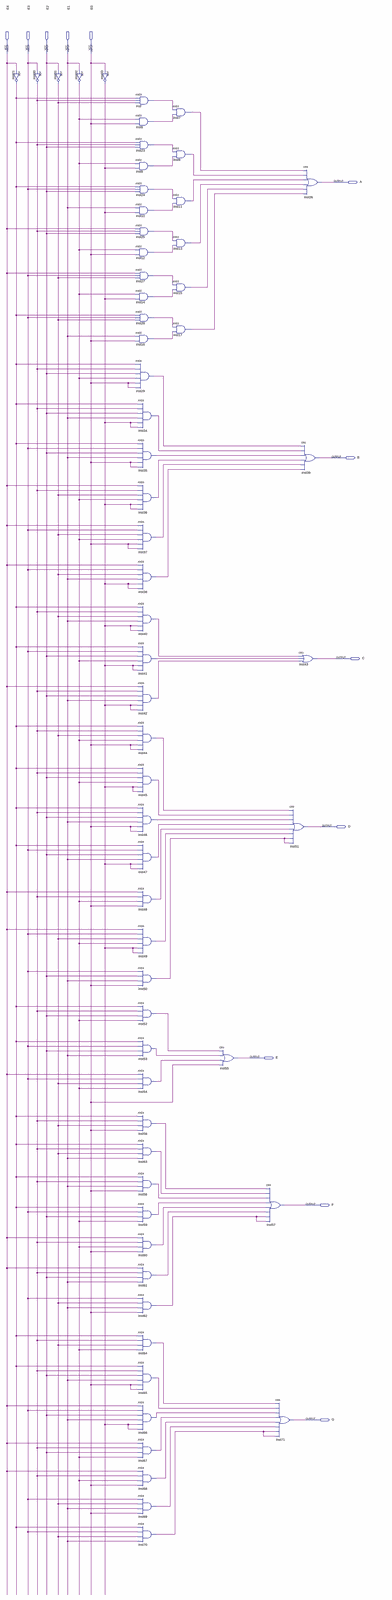
[diagram p0: schematic sheet, whole]
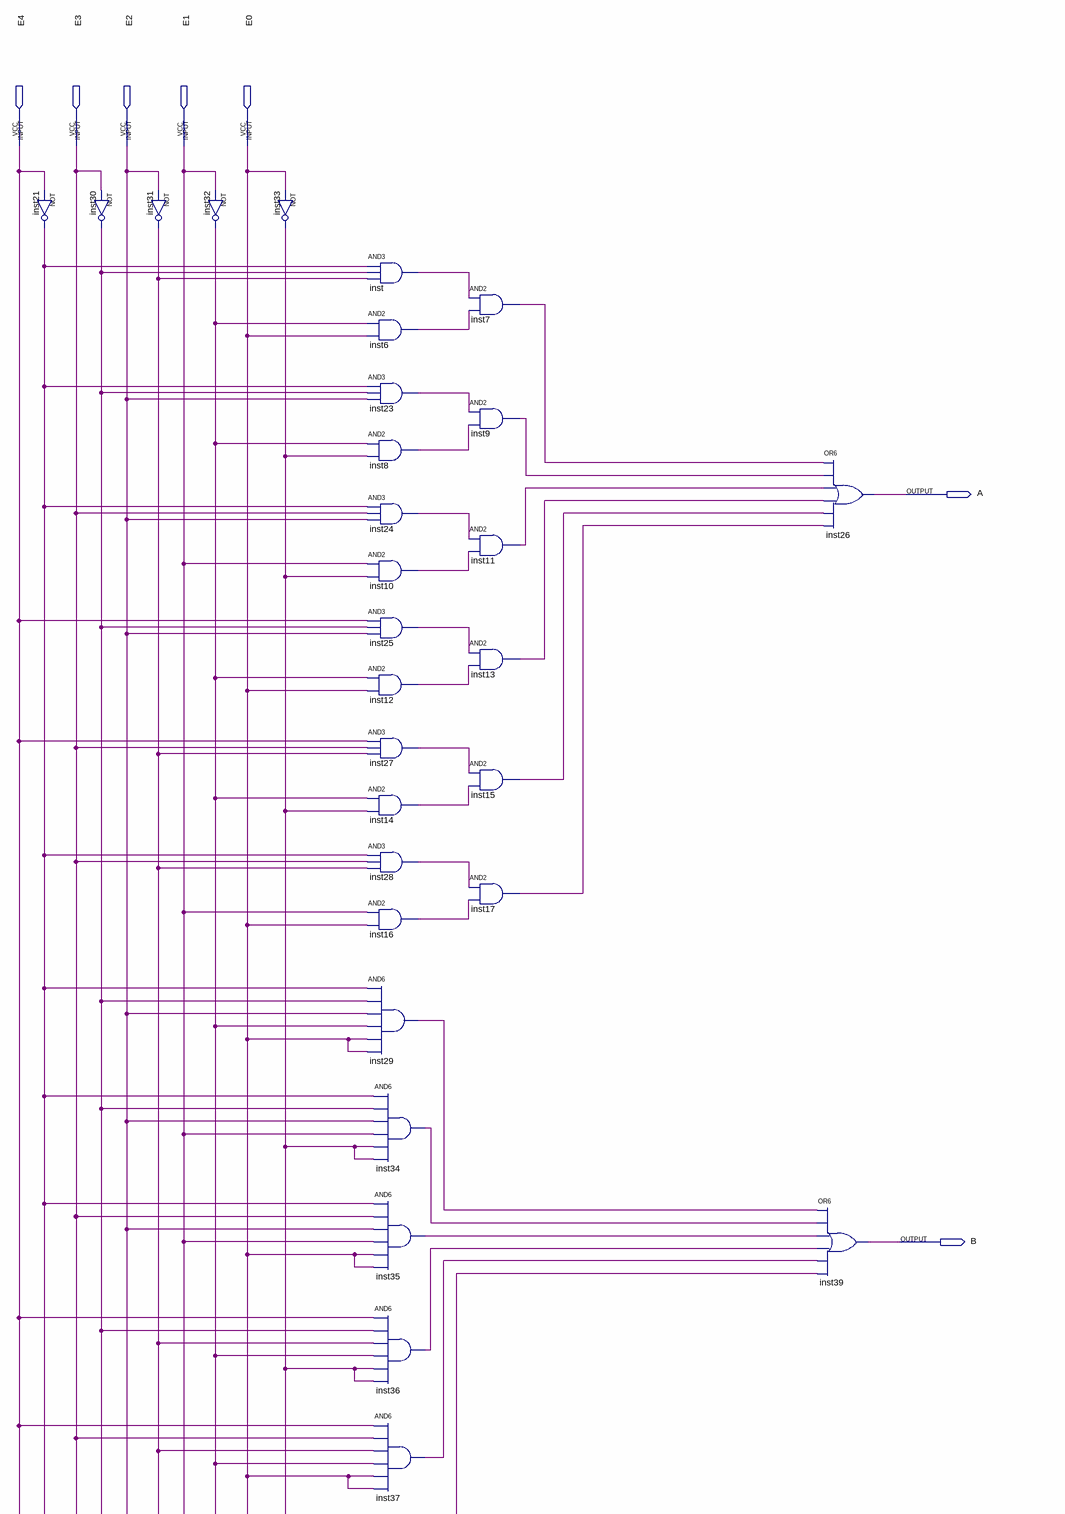
[diagram p1: schematic sheet, upper part]
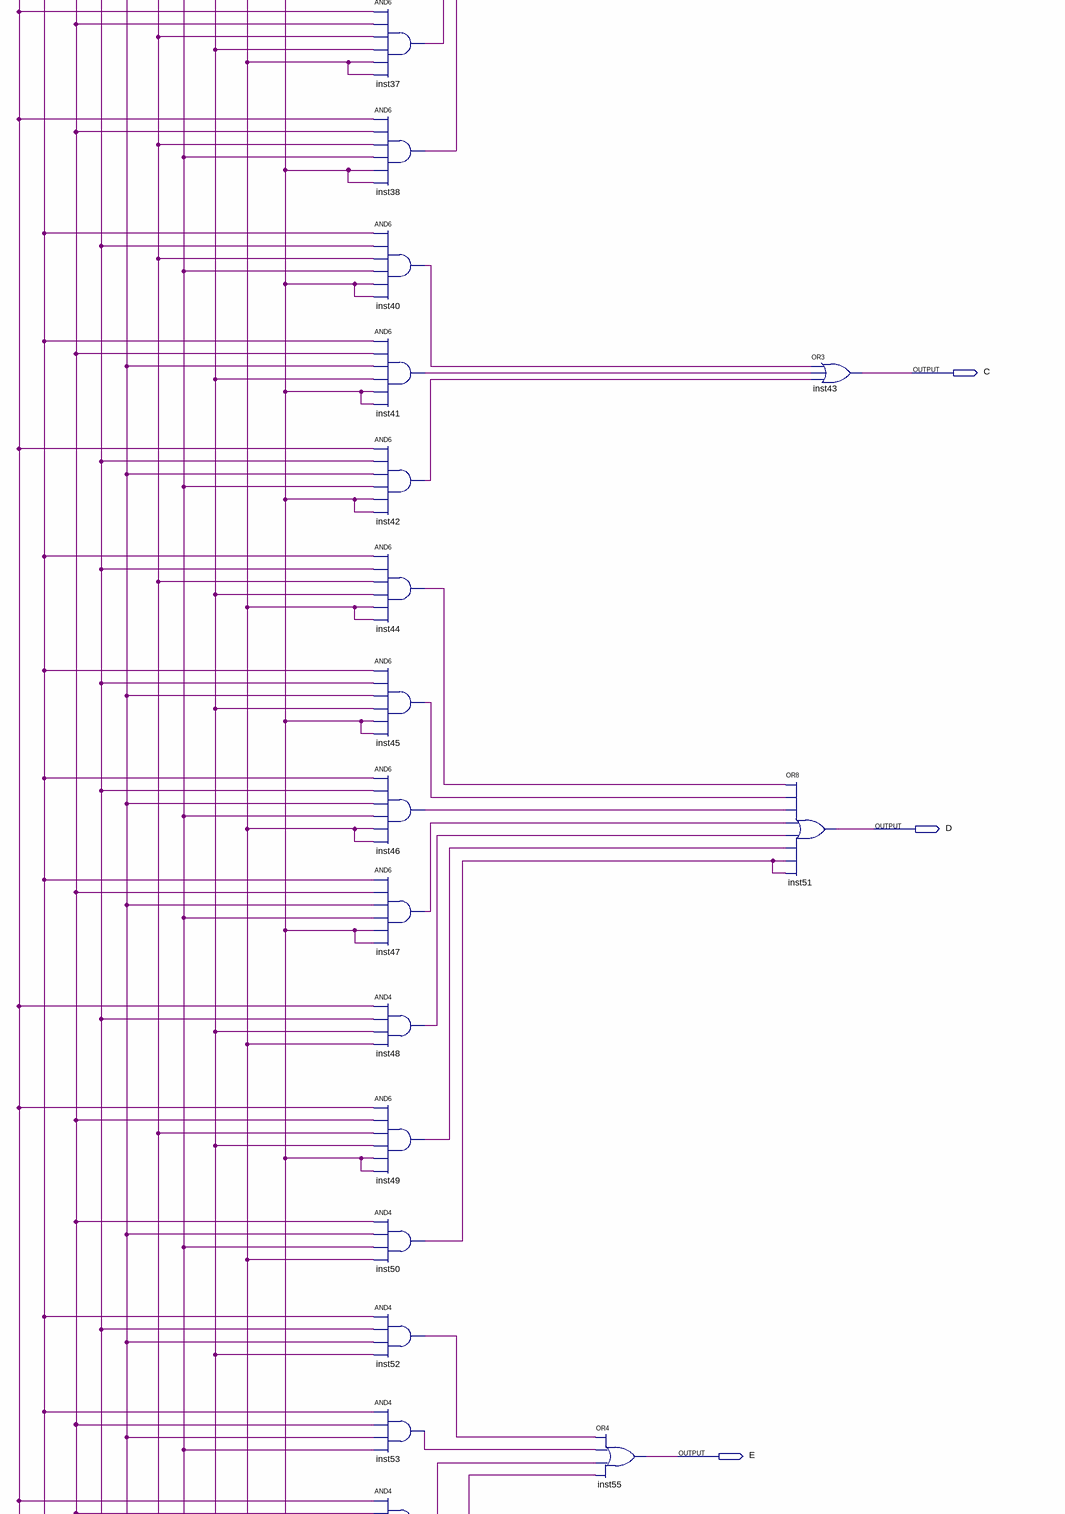
[diagram p2: schematic sheet, middle part]
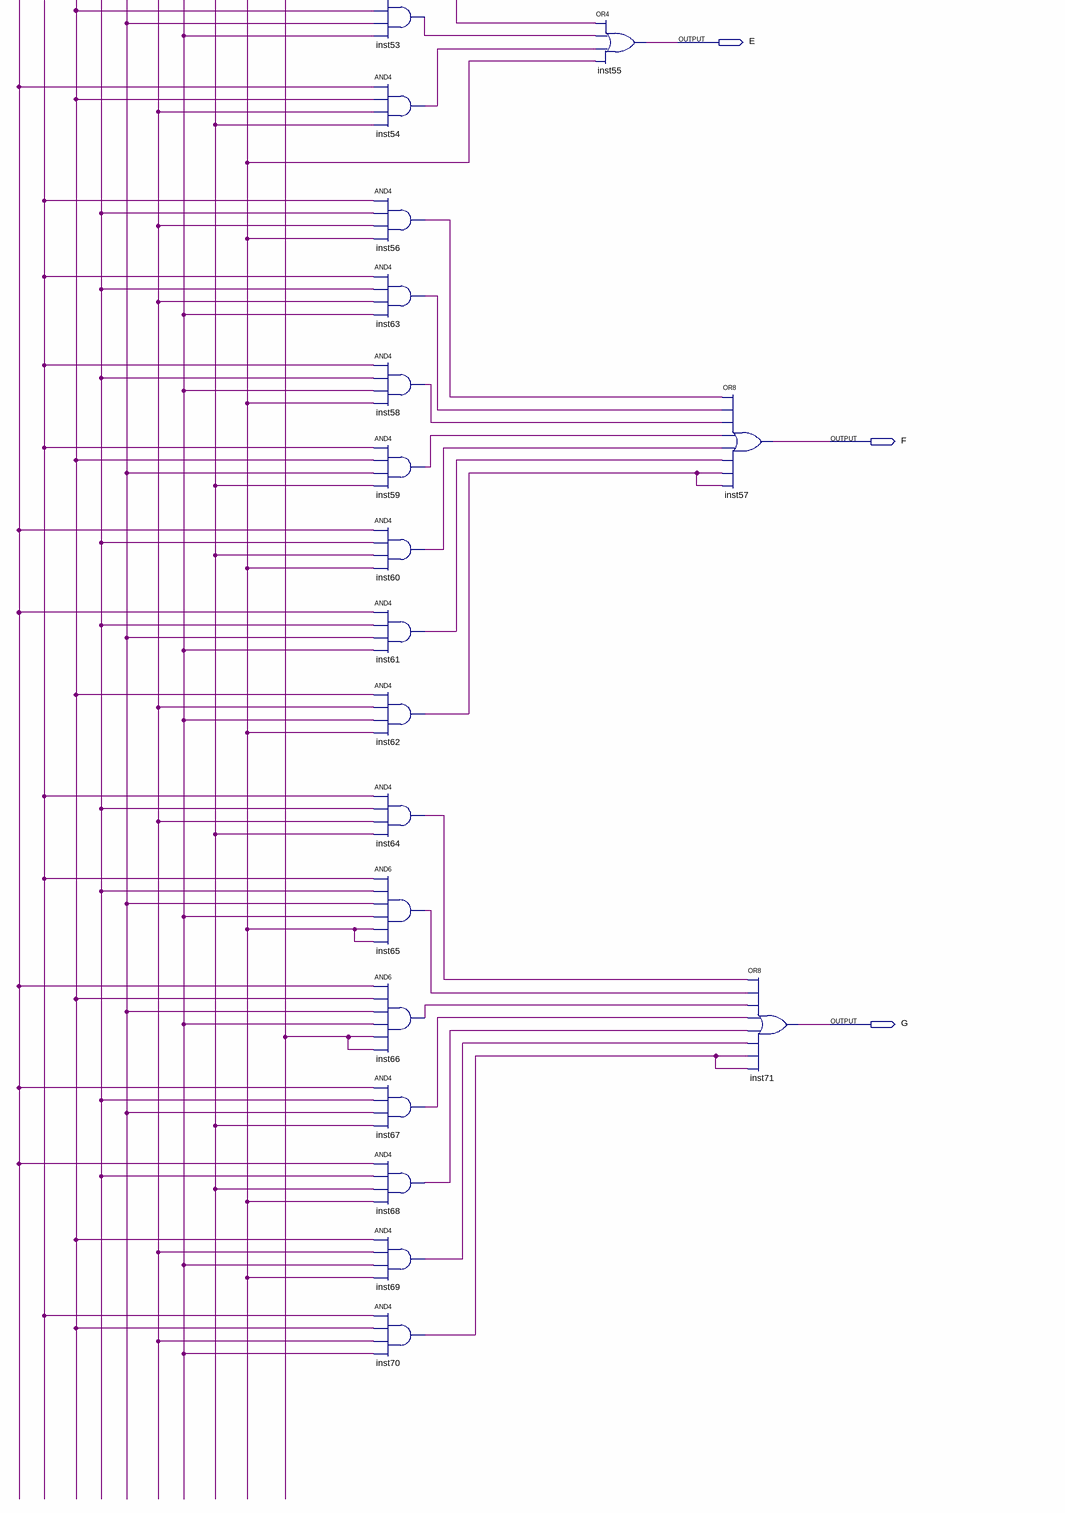
[diagram p3: schematic sheet, lower part]
// Quartus schematic UNIDADES.bdf as structural Verilog: 63 symbols, 12 pins
module UNIDADES (
  input  E4,
  input  E3,
  input  E2,
  input  E1,
  input  E0,
  output A,
  output B,
  output C,
  output D,
  output E,
  output F,
  output G
);

  wire inst6_out, inst7_out, inst8_out, inst9_out, inst10_out, inst11_out, inst12_out, inst13_out,
       inst14_out, inst15_out, inst16_out, inst17_out, inst21_out, inst23_out, inst24_out, inst25_out,
       inst27_out, inst28_out, inst29_out, inst30_out, inst31_out, inst32_out, inst33_out, inst34_out,
       inst35_out, inst36_out, inst37_out, inst38_out, inst40_out, inst41_out, inst42_out, inst44_out,
       inst45_out, inst46_out, inst47_out, inst48_out, inst49_out, inst50_out, inst52_out, inst53_out,
       inst54_out, inst56_out, inst58_out, inst59_out, inst60_out, inst61_out, inst62_out, inst63_out,
       inst64_out, inst65_out, inst66_out, inst67_out, inst68_out, inst69_out, inst70_out, inst_out;

  not inst21 (inst21_out, E4);
  not inst30 (inst30_out, E3);
  not inst31 (inst31_out, E2);
  not inst32 (inst32_out, E1);
  not inst33 (inst33_out, E0);
  and inst (inst_out, inst21_out, inst30_out, inst31_out);
  and inst6 (inst6_out, inst32_out, E0);
  and inst23 (inst23_out, inst21_out, inst30_out, E2);
  and inst8 (inst8_out, inst32_out, inst33_out);
  and inst24 (inst24_out, inst21_out, E3, E2);
  and inst10 (inst10_out, E1, inst33_out);
  and inst25 (inst25_out, E4, inst30_out, E2);
  and inst12 (inst12_out, inst32_out, E0);
  and inst27 (inst27_out, E4, E3, inst31_out);
  and inst14 (inst14_out, inst32_out, inst33_out);
  and inst28 (inst28_out, inst21_out, E3, inst31_out);
  and inst16 (inst16_out, E1, E0);
  and inst29 (inst29_out, inst21_out, inst30_out, E2, inst32_out, E0, E0);
  and inst34 (inst34_out, inst21_out, inst30_out, E2, E1, inst33_out, inst33_out);
  and inst35 (inst35_out, inst21_out, E3, E2, E1, E0, E0);
  and inst36 (inst36_out, E4, inst30_out, inst31_out, inst32_out, inst33_out, inst33_out);
  and inst37 (inst37_out, E4, E3, inst31_out, inst32_out, E0, E0);
  and inst38 (inst38_out, E4, E3, inst31_out, E1, inst33_out, inst33_out);
  and inst40 (inst40_out, inst21_out, inst30_out, inst31_out, E1, inst33_out, inst33_out);
  and inst41 (inst41_out, inst21_out, E3, E2, inst32_out, inst33_out, inst33_out);
  and inst42 (inst42_out, E4, inst30_out, E2, E1, inst33_out, inst33_out);
  and inst44 (inst44_out, inst21_out, inst30_out, inst31_out, inst32_out, E0, E0);
  and inst45 (inst45_out, inst21_out, inst30_out, E2, inst32_out, inst33_out, inst33_out);
  and inst46 (inst46_out, inst21_out, inst30_out, E2, E1, E0, E0);
  and inst47 (inst47_out, inst21_out, E3, E2, E1, inst33_out, inst33_out);
  and inst48 (inst48_out, E4, inst30_out, inst32_out, E0);
  and inst49 (inst49_out, E4, E3, inst31_out, inst32_out, inst33_out, inst33_out);
  and inst50 (inst50_out, E3, E2, E1, E0);
  and inst52 (inst52_out, inst21_out, inst30_out, E2, inst32_out);
  and inst53 (inst53_out, inst21_out, E3, E2, E1);
  and inst54 (inst54_out, E4, E3, inst31_out, inst32_out);
  and inst56 (inst56_out, inst21_out, inst30_out, inst31_out, E0);
  and inst63 (inst63_out, inst21_out, inst30_out, inst31_out, E1);
  and inst58 (inst58_out, inst21_out, inst30_out, E1, E0);
  and inst59 (inst59_out, inst21_out, E3, E2, inst32_out);
  and inst60 (inst60_out, E4, inst30_out, inst32_out, E0);
  and inst61 (inst61_out, E4, inst30_out, E2, E1);
  and inst62 (inst62_out, E3, inst31_out, E1, E0);
  and inst64 (inst64_out, inst21_out, inst30_out, inst31_out, inst32_out);
  and inst65 (inst65_out, inst21_out, inst30_out, E2, E1, E0, E0);
  and inst66 (inst66_out, E4, E3, E2, E1, inst33_out, inst33_out);
  and inst67 (inst67_out, E4, inst30_out, E2, inst32_out);
  and inst68 (inst68_out, E4, inst30_out, inst32_out, E0);
  and inst69 (inst69_out, E3, inst31_out, E1, E0);
  and inst70 (inst70_out, inst21_out, E3, inst31_out, E1);
  and inst7 (inst7_out, inst_out, inst6_out);
  and inst9 (inst9_out, inst23_out, inst8_out);
  and inst11 (inst11_out, inst24_out, inst10_out);
  and inst13 (inst13_out, inst25_out, inst12_out);
  and inst15 (inst15_out, inst27_out, inst14_out);
  and inst17 (inst17_out, inst28_out, inst16_out);
  or inst55 (E, inst52_out, inst53_out, inst54_out, E0);
  or inst57 (F, inst56_out, inst63_out, inst58_out, inst59_out, inst60_out, inst61_out, inst62_out, inst62_out);
  or inst71 (G, inst64_out, inst65_out, inst66_out, inst67_out, inst68_out, inst69_out, inst70_out, inst70_out);
  or inst26 (A, inst7_out, inst9_out, inst11_out, inst13_out, inst15_out, inst17_out);
  or inst39 (B, inst29_out, inst34_out, inst35_out, inst36_out, inst37_out, inst38_out);
  or inst43 (C, inst40_out, inst41_out, inst42_out);
  or inst51 (D, inst44_out, inst45_out, inst46_out, inst47_out, inst48_out, inst49_out, inst50_out, inst50_out);
endmodule
